# Altium schematic sheet AM-RAM.SchDoc
size A
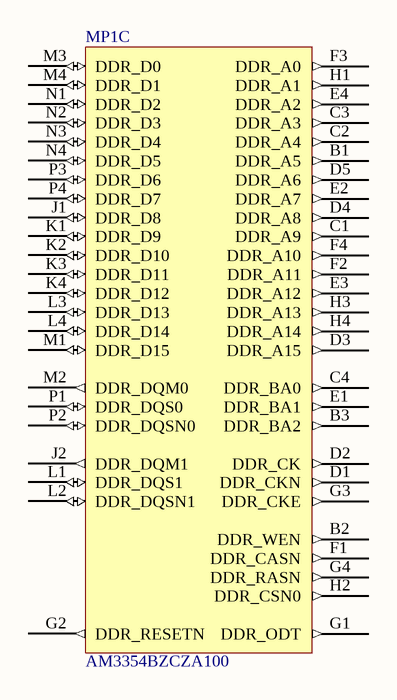
[diagram p0: AM-RAM.SchDoc]

## Parts
MP1  AM3354BZCZA100  [TI-ZCZ324]  (part C of 9)

## Nets

Not connected (* = marked no-connect by the designer): MP1 B1(DDR_A5) B2(DDR_WEN) B3(DDR_BA2) C1(DDR_A9) C2(DDR_A4) C3(DDR_A3) C4(DDR_BA0) D1(DDR_CKN) D2(DDR_CK) D3(DDR_A15) D4(DDR_A8) D5(DDR_A6) E1(DDR_BA1) E2(DDR_A7) E3(DDR_A12) E4(DDR_A2) F1(DDR_CASN) F2(DDR_A11) F3(DDR_A0) F4(DDR_A10) G1(DDR_ODT) G2(DDR_RESETN) G3(DDR_CKE) G4(DDR_RASN) H1(DDR_A1) H2(DDR_CSN0) H3(DDR_A13) H4(DDR_A14) J1(DDR_D8) J2(DDR_DQM1) K1(DDR_D9) K2(DDR_D10) K3(DDR_D11) K4(DDR_D12) L1(DDR_DQS1) L2(DDR_DQSN1) L3(DDR_D13) L4(DDR_D14) M1(DDR_D15) M2(DDR_DQM0) M3(DDR_D0) M4(DDR_D1) N1(DDR_D2) N2(DDR_D3) N3(DDR_D4) N4(DDR_D5) P1(DDR_DQS0) P2(DDR_DQSN0) P3(DDR_D6) P4(DDR_D7)

## Library data of the parts
MP1 = CMP-0547-00017-2: Sitara ARM Cortex-A8 32-Bit RISC Microprocessor, 1 GHz, SGX530 3D Graphics Engine, Programmable Real-Time Unit and Industrial Communication Subsystem (PRU-ICSS), -40 to 105 degC, 324-pin NFBGA (ZCZ), Green (RoHS & no Sb/Br); Manufacturer: Texas Instruments; eQEP: 3; CAN: 2; UART (SCI): 6; ComponentLink2Description: Datasheet; Mounting Technology: Surface Mount; ComponentLink3Description: Package Specification; Operating Temperature: -40 to 105 degC; PackageReference: ZCZ324; ComponentLink3URL: http://www.ti.com/lit/ds/symlink/am3352.pdf; ARM CPU: Cortex-A8; SPI: 2; ComponentLink2URL: http://www.ti.com/lit/ds/symlink/am3352.pdf; ComponentLink1URL: http://www.ti.com/; PackageVersion: 4211570/A; DatasheetVersion: SPRS717F; eCAP: 3; ComponentLink1Description: Manufacturer URL; PartNumber: AM3354BZCZA100; I2C: 3; PackageDescription: 324-Pin Plastic Ball Grid Array, Body 15 x 15 mm, Pitch 0.8 mm